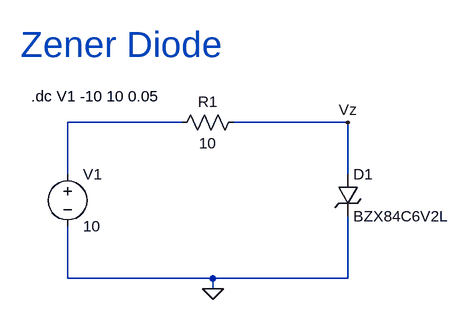
[diagram p0: schematic Zener diode.asc]
Zener diode.asc, the LTspice schematic file:
Version 4
SHEET 1 880 680
WIRE 144 144 -32 144
WIRE 400 144 224 144
WIRE -32 224 -32 144
WIRE 400 224 400 144
WIRE -32 384 -32 304
WIRE 192 384 -32 384
WIRE 400 384 400 288
WIRE 400 384 192 384
WIRE 192 400 192 384
FLAG 192 400 0
FLAG 400 144 Vz
SYMBOL zener 384 224 R0
SYMATTR InstName D1
SYMATTR Value BZX84C6V2L
SYMBOL voltage -32 208 R0
SYMATTR InstName V1
SYMATTR Value 10
SYMBOL res 240 128 R90
WINDOW 0 0 56 VBottom 2
WINDOW 3 32 56 VTop 2
SYMATTR InstName R1
SYMATTR Value 10
TEXT -88 104 Left 2 !.dc V1 -10 10 0.05
TEXT -104 24 Left 5 ;Zener Diode

The netlist it stands for:
* Zener diode.asc
D1 Vz 0 BZX84C6V2L
V1 N001 0 10
R1 Vz N001 10
.model D D
.lib standard.dio
.dc V1 -10 10 0.05
* Zener Diode
.backanno
.end